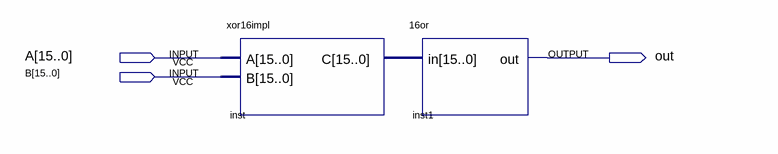
[diagram p0: schematic sheet]
// Quartus schematic ex1ALU_CMP.bdf as structural Verilog: 2 symbols, 3 pins
module ex1ALU_CMP (
  input  [15:0] A,
  input  [15:0] B,
  output out
);

  wire [15:0] inst_c;

  xor16impl inst (.A(A), .B(B), .C(inst_c));
  \16or  inst1 (.in(inst_c), .out(out));
endmodule
